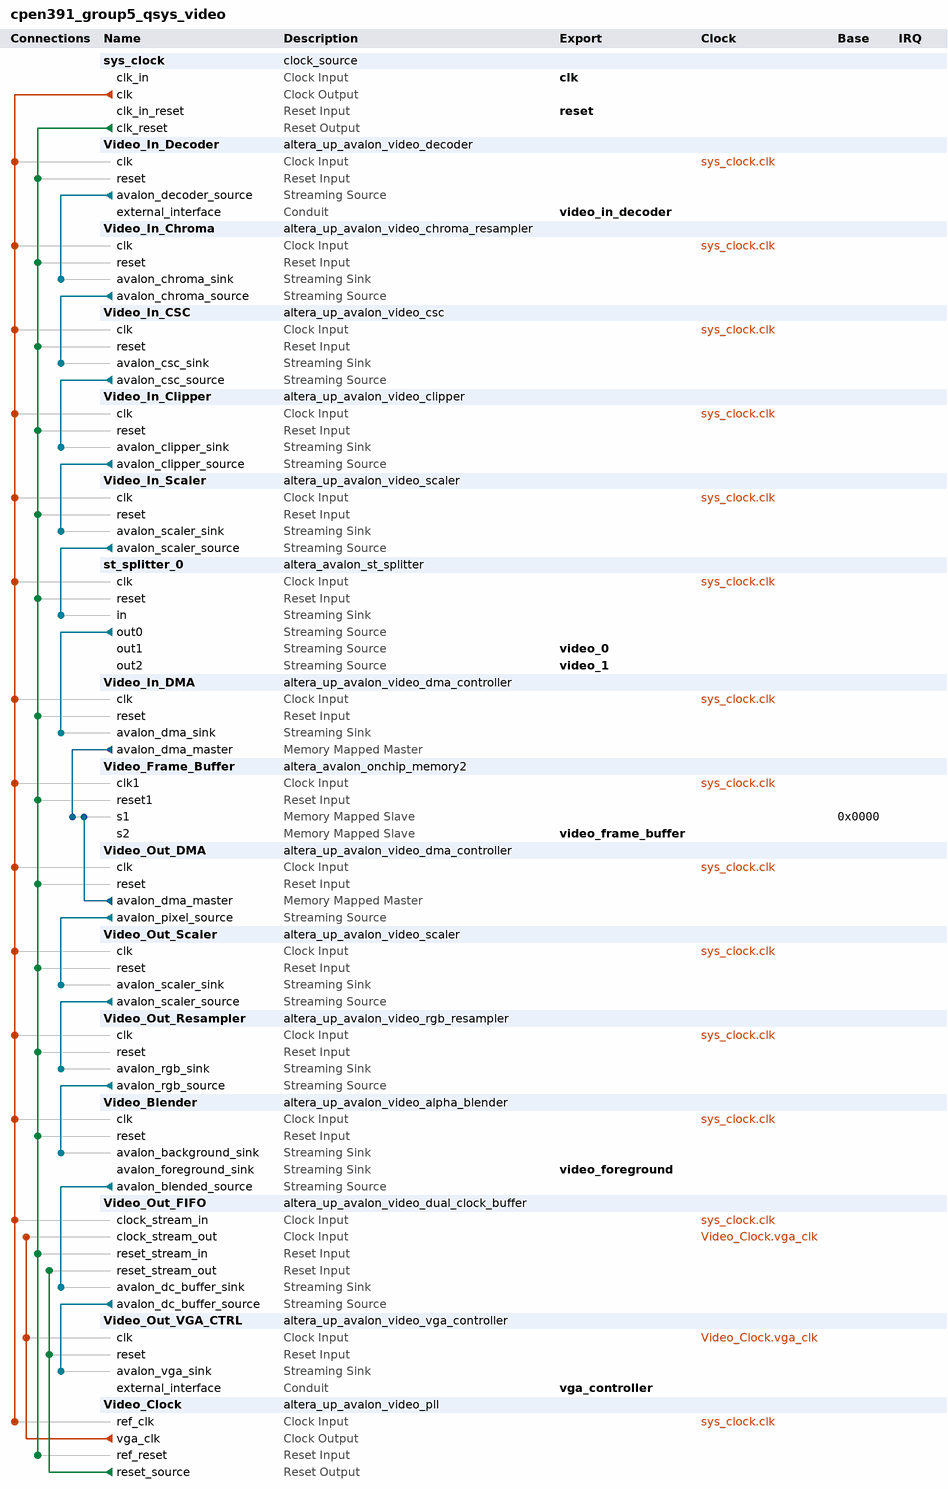
[diagram p0: system contents]
# Platform Designer (Qsys) system cpen391_group5_qsys_video, Cyclone V 5CSEMA5F31C6
# Parameters at their usual value, and those the tool derives, are not listed.
package require -exact qsys 15.0
create_system cpen391_group5_qsys_video
set_project_property DEVICE_FAMILY {Cyclone V}
set_project_property DEVICE 5CSEMA5F31C6

add_instance sys_clock clock_source 15.0
set_instance_parameter_value sys_clock clockFrequency 50000000

add_instance Video_In_Decoder altera_up_avalon_video_decoder 15.0

add_instance Video_In_Chroma altera_up_avalon_video_chroma_resampler 15.0

add_instance Video_In_CSC altera_up_avalon_video_csc 15.0

add_instance Video_In_Clipper altera_up_avalon_video_clipper 15.0
set_instance_parameter_value Video_In_Clipper color_bits 8
set_instance_parameter_value Video_In_Clipper color_planes 3

add_instance Video_In_Scaler altera_up_avalon_video_scaler 15.0
set_instance_parameter_value Video_In_Scaler color_bits 8
set_instance_parameter_value Video_In_Scaler color_planes 3
set_instance_parameter_value Video_In_Scaler height_scaling 1
set_instance_parameter_value Video_In_Scaler width_in 640
set_instance_parameter_value Video_In_Scaler width_scaling 0.5

add_instance st_splitter_0 altera_avalon_st_splitter 15.0
set_instance_parameter_value st_splitter_0 BITS_PER_SYMBOL 8
set_instance_parameter_value st_splitter_0 CHANNEL_WIDTH 1
set_instance_parameter_value st_splitter_0 DATA_WIDTH 24
set_instance_parameter_value st_splitter_0 ERROR_WIDTH 1
set_instance_parameter_value st_splitter_0 MAX_CHANNELS 1
set_instance_parameter_value st_splitter_0 NUMBER_OF_OUTPUTS 3
set_instance_parameter_value st_splitter_0 QUALIFY_VALID_OUT 1
set_instance_parameter_value st_splitter_0 READY_LATENCY 0
set_instance_parameter_value st_splitter_0 USE_CHANNEL 0
set_instance_parameter_value st_splitter_0 USE_DATA 1
set_instance_parameter_value st_splitter_0 USE_ERROR 0
set_instance_parameter_value st_splitter_0 USE_PACKETS 1
set_instance_parameter_value st_splitter_0 USE_READY 1
set_instance_parameter_value st_splitter_0 USE_VALID 1

add_instance Video_In_DMA altera_up_avalon_video_dma_controller 15.0
set_instance_parameter_value Video_In_DMA addr_mode Consecutive
set_instance_parameter_value Video_In_DMA back_start_address 0
set_instance_parameter_value Video_In_DMA color_bits 8
set_instance_parameter_value Video_In_DMA color_planes 3
set_instance_parameter_value Video_In_DMA dma_enabled true
set_instance_parameter_value Video_In_DMA height 240
set_instance_parameter_value Video_In_DMA mode {From Stream to Memory}
set_instance_parameter_value Video_In_DMA start_address 0
set_instance_parameter_value Video_In_DMA width 320

add_instance Video_Frame_Buffer altera_avalon_onchip_memory2 15.0
set_instance_parameter_value Video_Frame_Buffer blockType M10K
set_instance_parameter_value Video_Frame_Buffer dataWidth 32
set_instance_parameter_value Video_Frame_Buffer dualPort true
set_instance_parameter_value Video_Frame_Buffer initMemContent false
set_instance_parameter_value Video_Frame_Buffer initializationFileName onchip_mem.hex
set_instance_parameter_value Video_Frame_Buffer memorySize 307200
set_instance_parameter_value Video_Frame_Buffer singleClockOperation true

add_instance Video_Out_DMA altera_up_avalon_video_dma_controller 15.0
set_instance_parameter_value Video_Out_DMA addr_mode Consecutive
set_instance_parameter_value Video_Out_DMA back_start_address 0
set_instance_parameter_value Video_Out_DMA color_bits 8
set_instance_parameter_value Video_Out_DMA color_planes 3
set_instance_parameter_value Video_Out_DMA dma_enabled true
set_instance_parameter_value Video_Out_DMA height 240
set_instance_parameter_value Video_Out_DMA mode {From Memory to Stream}
set_instance_parameter_value Video_Out_DMA start_address 0
set_instance_parameter_value Video_Out_DMA width 320

add_instance Video_Out_Scaler altera_up_avalon_video_scaler 15.0
set_instance_parameter_value Video_Out_Scaler color_bits 8
set_instance_parameter_value Video_Out_Scaler color_planes 3
set_instance_parameter_value Video_Out_Scaler height_scaling 2
set_instance_parameter_value Video_Out_Scaler width_in 320
set_instance_parameter_value Video_Out_Scaler width_scaling 2

add_instance Video_Out_Resampler altera_up_avalon_video_rgb_resampler 15.0
set_instance_parameter_value Video_Out_Resampler alpha 255
set_instance_parameter_value Video_Out_Resampler input_type {24-bit RGB}
set_instance_parameter_value Video_Out_Resampler output_type {30-bit RGB}

add_instance Video_Blender altera_up_avalon_video_alpha_blender 15.0
set_instance_parameter_value Video_Blender mode Normal

add_instance Video_Out_FIFO altera_up_avalon_video_dual_clock_buffer 15.0
set_instance_parameter_value Video_Out_FIFO color_bits 10

add_instance Video_Out_VGA_CTRL altera_up_avalon_video_vga_controller 15.0
set_instance_parameter_value Video_Out_VGA_CTRL board DE1-SoC
set_instance_parameter_value Video_Out_VGA_CTRL resolution {VGA 640x480}

add_instance Video_Clock altera_up_avalon_video_pll 15.0
set_instance_parameter_value Video_Clock camera {5MP Digital Camera}
set_instance_parameter_value Video_Clock gui_refclk 50.0
set_instance_parameter_value Video_Clock lcd {7" LCD on VEEK-MT and MTL Module}

# connections
add_connection sys_clock.clk st_splitter_0.clk clock
add_connection sys_clock.clk Video_Blender.clk clock
add_connection sys_clock.clk Video_Clock.ref_clk clock
add_connection sys_clock.clk Video_Frame_Buffer.clk1 clock
add_connection sys_clock.clk Video_In_Chroma.clk clock
add_connection sys_clock.clk Video_In_Clipper.clk clock
add_connection sys_clock.clk Video_In_CSC.clk clock
add_connection sys_clock.clk Video_In_Decoder.clk clock
add_connection sys_clock.clk Video_In_DMA.clk clock
add_connection sys_clock.clk Video_In_Scaler.clk clock
add_connection sys_clock.clk Video_Out_DMA.clk clock
add_connection sys_clock.clk Video_Out_FIFO.clock_stream_in clock
add_connection sys_clock.clk Video_Out_Resampler.clk clock
add_connection sys_clock.clk Video_Out_Scaler.clk clock
add_connection Video_Clock.vga_clk Video_Out_FIFO.clock_stream_out clock
add_connection Video_Clock.vga_clk Video_Out_VGA_CTRL.clk clock
add_connection sys_clock.clk_reset st_splitter_0.reset reset
add_connection sys_clock.clk_reset Video_Blender.reset reset
add_connection sys_clock.clk_reset Video_Clock.ref_reset reset
add_connection sys_clock.clk_reset Video_Frame_Buffer.reset1 reset
add_connection sys_clock.clk_reset Video_In_Chroma.reset reset
add_connection sys_clock.clk_reset Video_In_Clipper.reset reset
add_connection sys_clock.clk_reset Video_In_CSC.reset reset
add_connection sys_clock.clk_reset Video_In_Decoder.reset reset
add_connection sys_clock.clk_reset Video_In_DMA.reset reset
add_connection sys_clock.clk_reset Video_In_Scaler.reset reset
add_connection sys_clock.clk_reset Video_Out_DMA.reset reset
add_connection sys_clock.clk_reset Video_Out_FIFO.reset_stream_in reset
add_connection sys_clock.clk_reset Video_Out_Resampler.reset reset
add_connection sys_clock.clk_reset Video_Out_Scaler.reset reset
add_connection Video_Clock.reset_source Video_Out_FIFO.reset_stream_out reset
add_connection Video_Clock.reset_source Video_Out_VGA_CTRL.reset reset
add_connection Video_In_DMA.avalon_dma_master Video_Frame_Buffer.s1 avalon
set_connection_parameter_value Video_In_DMA.avalon_dma_master/Video_Frame_Buffer.s1 baseAddress 0x0000
add_connection Video_Out_DMA.avalon_dma_master Video_Frame_Buffer.s1 avalon
set_connection_parameter_value Video_Out_DMA.avalon_dma_master/Video_Frame_Buffer.s1 baseAddress 0x0000
add_connection st_splitter_0.out0 Video_In_DMA.avalon_dma_sink avalon_streaming
add_connection Video_Blender.avalon_blended_source Video_Out_FIFO.avalon_dc_buffer_sink avalon_streaming
add_connection Video_In_Chroma.avalon_chroma_source Video_In_CSC.avalon_csc_sink avalon_streaming
add_connection Video_In_Clipper.avalon_clipper_source Video_In_Scaler.avalon_scaler_sink avalon_streaming
add_connection Video_In_CSC.avalon_csc_source Video_In_Clipper.avalon_clipper_sink avalon_streaming
add_connection Video_In_Decoder.avalon_decoder_source Video_In_Chroma.avalon_chroma_sink avalon_streaming
add_connection Video_In_Scaler.avalon_scaler_source st_splitter_0.in avalon_streaming
add_connection Video_Out_DMA.avalon_pixel_source Video_Out_Scaler.avalon_scaler_sink avalon_streaming
add_connection Video_Out_FIFO.avalon_dc_buffer_source Video_Out_VGA_CTRL.avalon_vga_sink avalon_streaming
add_connection Video_Out_Resampler.avalon_rgb_source Video_Blender.avalon_background_sink avalon_streaming
add_connection Video_Out_Scaler.avalon_scaler_source Video_Out_Resampler.avalon_rgb_sink avalon_streaming

# exported interfaces
add_interface clk clock sink
set_interface_property clk EXPORT_OF sys_clock.clk_in
add_interface reset reset sink
set_interface_property reset EXPORT_OF sys_clock.clk_in_reset
add_interface vga_controller conduit end
set_interface_property vga_controller EXPORT_OF Video_Out_VGA_CTRL.external_interface
add_interface video_0 avalon_streaming source
set_interface_property video_0 EXPORT_OF st_splitter_0.out1
add_interface video_1 avalon_streaming source
set_interface_property video_1 EXPORT_OF st_splitter_0.out2
add_interface video_foreground avalon_streaming sink
set_interface_property video_foreground EXPORT_OF Video_Blender.avalon_foreground_sink
add_interface video_frame_buffer avalon slave
set_interface_property video_frame_buffer EXPORT_OF Video_Frame_Buffer.s2
add_interface video_in_decoder conduit end
set_interface_property video_in_decoder EXPORT_OF Video_In_Decoder.external_interface

set_interconnect_requirement {$system} qsys_mm.clockCrossingAdapter HANDSHAKE
set_interconnect_requirement {$system} qsys_mm.enableEccProtection FALSE
set_interconnect_requirement {$system} qsys_mm.insertDefaultSlave FALSE
set_interconnect_requirement {$system} qsys_mm.maxAdditionalLatency 1

save_system cpen391_group5_qsys_video.qsys
